# EasyEDA Pro project ProProject_运放实验_2024-09-24.epro, schematic Schematic2
Create Date: 2023-09-07; Page Name: P1; Project Name: 运放实验; Schematic Name: Schematic2; Update Date: 2023-09-08; Company: 嘉立创EDA; Page Size: A4; Version: V1.0
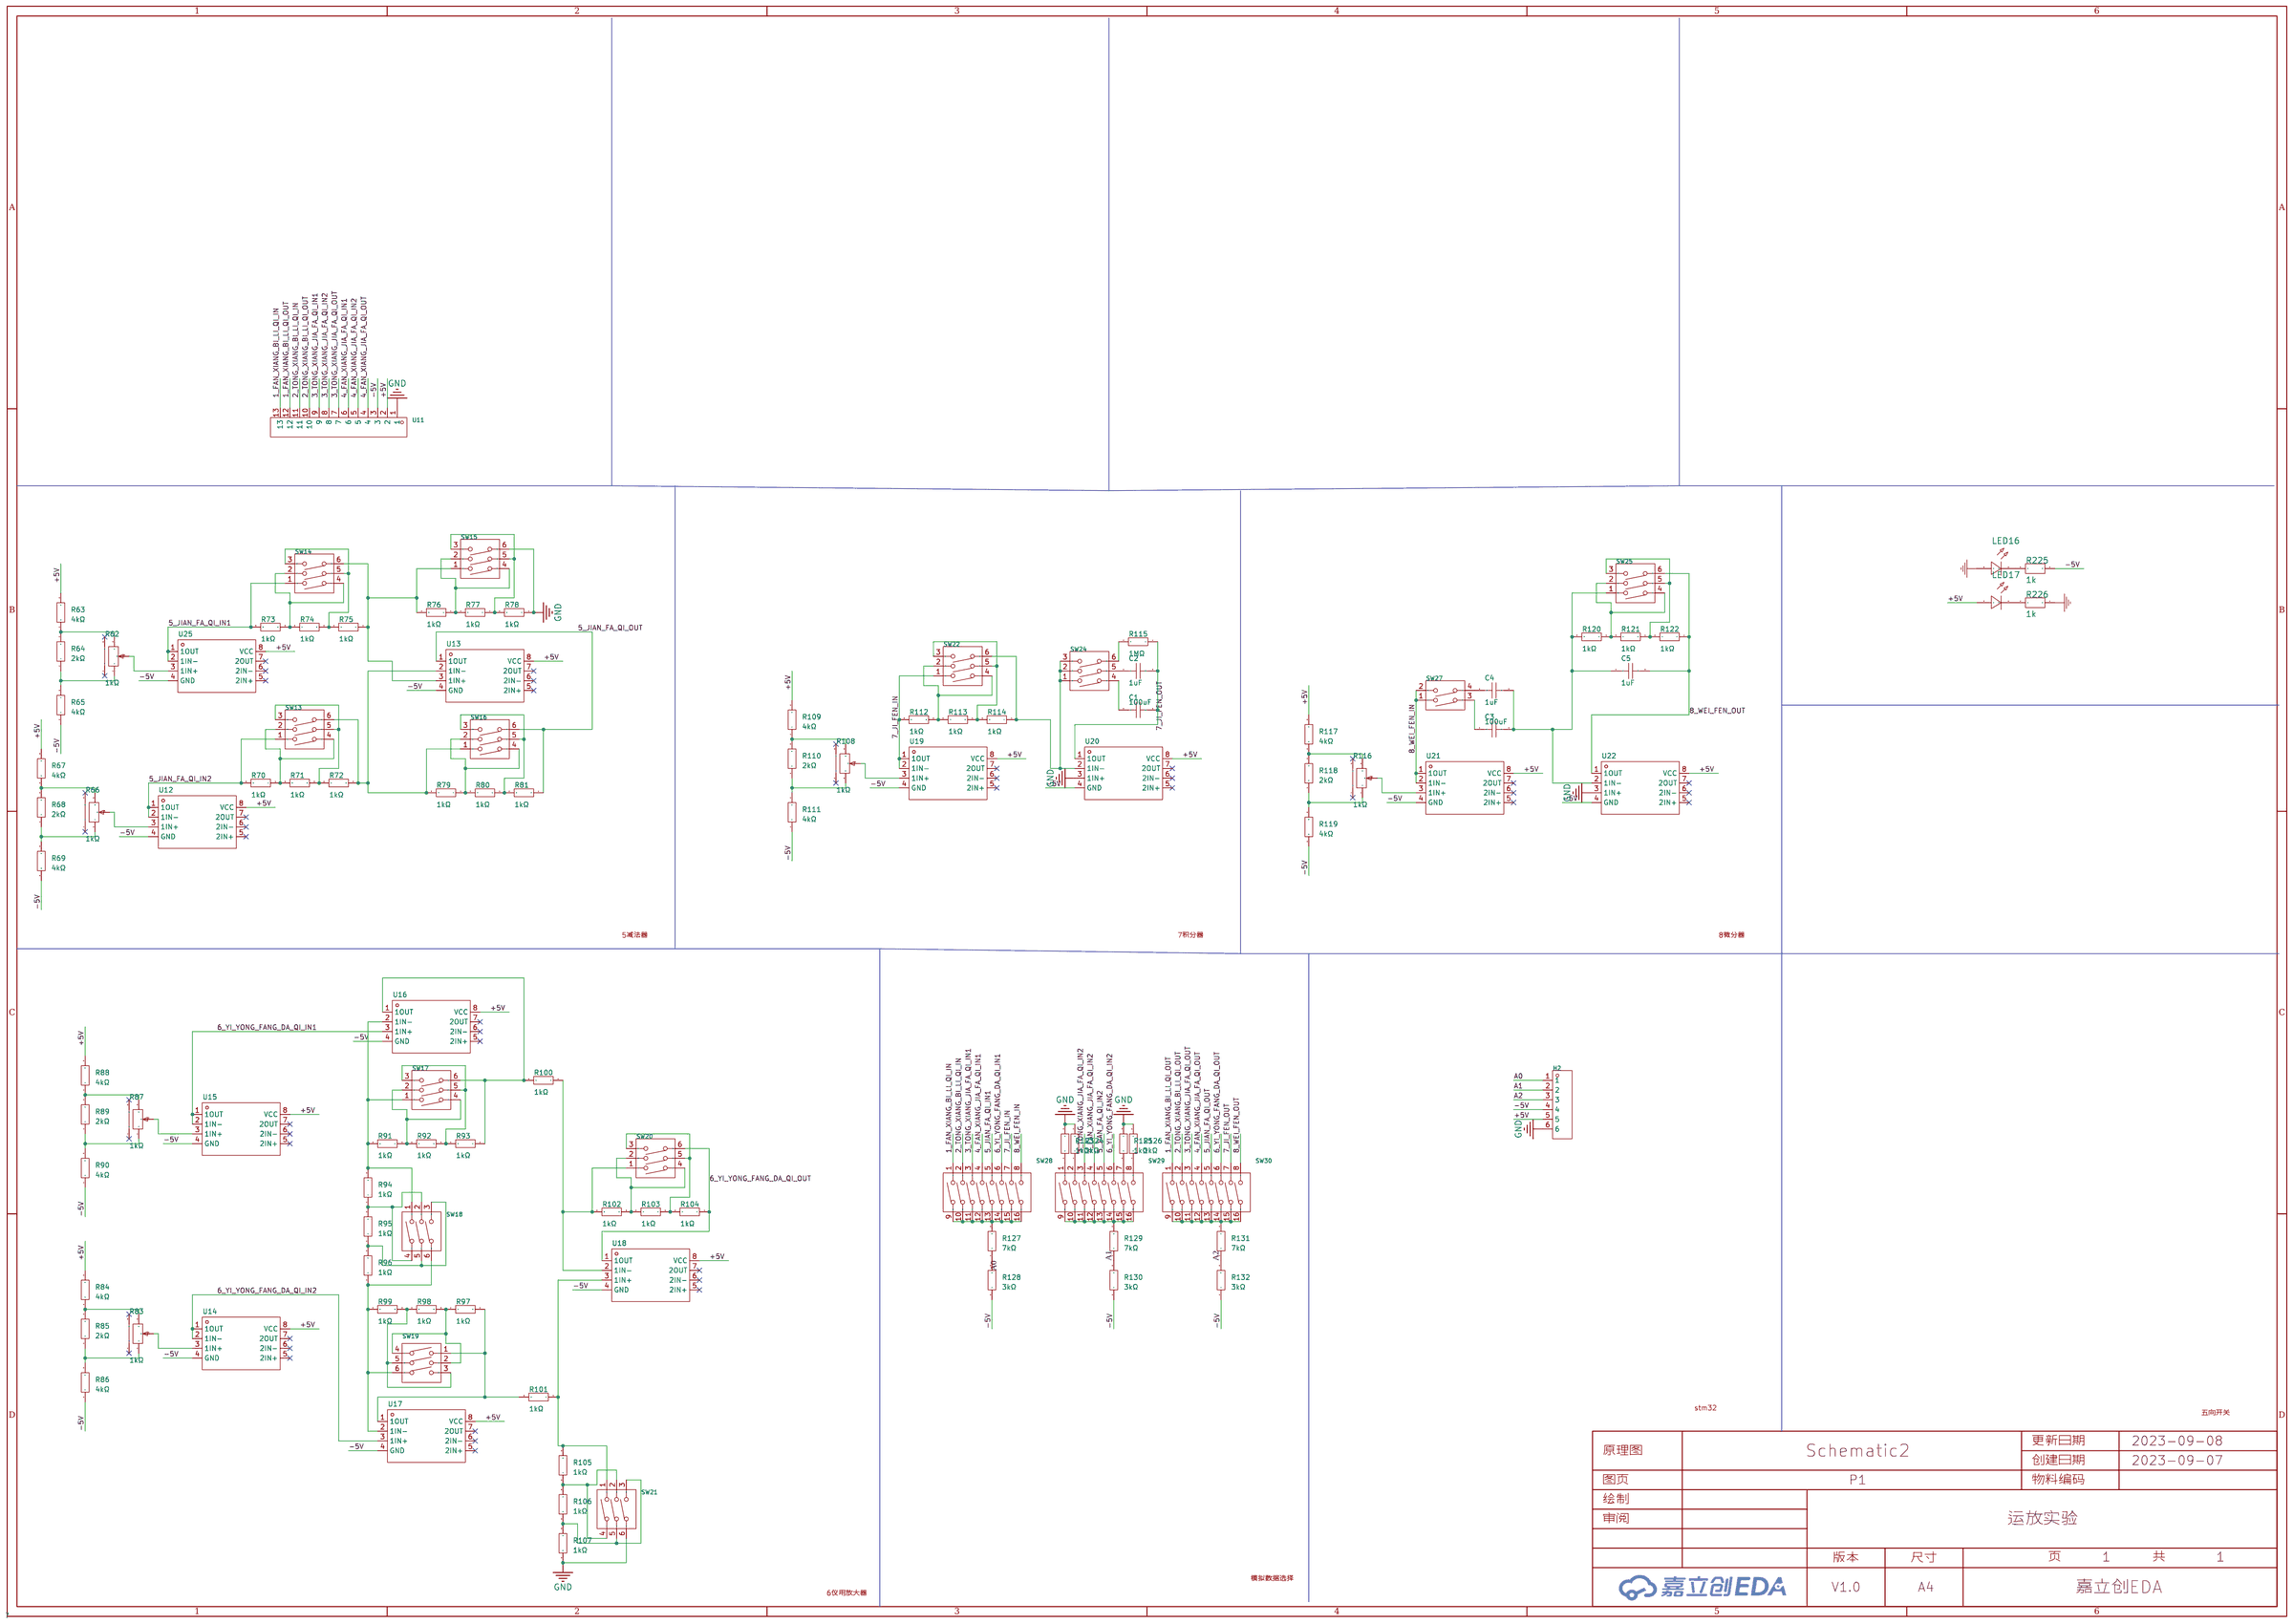
[diagram p1: schematic sheet]

## Parts
C1  100uF  [C0603]
C2  1uF  [C0603]
C3  100uF  [C0603]
C4  1uF  [C0603]
C5  1uF  [C0603]
H2  PM254V-11-06-H85  [HDR-TH_6P-P2.54-V-F]
LED16  -  [LED_0805]
LED17  -  [LED_0805]
R62  1kΩ  [RES-ADJ-TH_RK09K1130AJ3]
R63  4kΩ  [R0603]
R64  2kΩ  [R0603]
R65  4kΩ  [R0603]
R66  1kΩ  [RES-ADJ-TH_RK09K1130AJ3]
R67  4kΩ  [R0603]
R68  2kΩ  [R0603]
R69  4kΩ  [R0603]
R70  1kΩ  [R0603]
R71  1kΩ  [R0603]
R72  1kΩ  [R0603]
R73  1kΩ  [R0603]
R74  1kΩ  [R0603]
R75  1kΩ  [R0603]
R76  1kΩ  [R0603]
R77  1kΩ  [R0603]
R78  1kΩ  [R0603]
R79  1kΩ  [R0603]
R80  1kΩ  [R0603]
R81  1kΩ  [R0603]
R83  1kΩ  [RES-ADJ-TH_RK09K1130AJ3]
R84  4kΩ  [R0603]
R85  2kΩ  [R0603]
R86  4kΩ  [R0603]
R87  1kΩ  [RES-ADJ-TH_RK09K1130AJ3]
R88  4kΩ  [R0603]
R89  2kΩ  [R0603]
R90  4kΩ  [R0603]
R91  1kΩ  [R0603]
R92  1kΩ  [R0603]
R93  1kΩ  [R0603]
R94  1kΩ  [R0603]
R95  1kΩ  [R0603]
R96  1kΩ  [R0603]
R97  1kΩ  [R0603]
R98  1kΩ  [R0603]
R99  1kΩ  [R0603]
R100  1kΩ  [R0603]
R101  1kΩ  [R0603]
R102  1kΩ  [R0603]
R103  1kΩ  [R0603]
R104  1kΩ  [R0603]
R105  1kΩ  [R0603]
R106  1kΩ  [R0603]
R107  1kΩ  [R0603]
R108  1kΩ  [RES-ADJ-TH_RK09K1130AJ3]
R109  4kΩ  [R0603]
R110  2kΩ  [R0603]
R111  4kΩ  [R0603]
R112  1kΩ  [R0603]
R113  1kΩ  [R0603]
R114  1kΩ  [R0603]
R115  1MΩ  [R0603]
R116  1kΩ  [RES-ADJ-TH_RK09K1130AJ3]
R117  4kΩ  [R0603]
R118  2kΩ  [R0603]
R119  4kΩ  [R0603]
R120  1kΩ  [R0603]
R121  1kΩ  [R0603]
R122  1kΩ  [R0603]
R123  1kΩ  [R0603]
R124  1kΩ  [R0603]
R125  1kΩ  [R0603]
R126  1kΩ  [R0603]
R127  7kΩ  [R0603]
R128  3kΩ  [R0603]
R129  7kΩ  [R0603]
R130  3kΩ  [R0603]
R131  7kΩ  [R0603]
R132  3kΩ  [R0603]
R225  1k  [R0805]
R226  1k  [R0805]
SW13  DSWB03LHGET  [SW-TH_DSWB03LHGET]
SW14  DSWB03LHGET  [SW-TH_DSWB03LHGET]
SW15  DSWB03LHGET  [SW-TH_DSWB03LHGET]
SW16  DSWB03LHGET  [SW-TH_DSWB03LHGET]
SW17  DSWB03LHGET  [SW-TH_DSWB03LHGET]
SW18  DSWB03LHGET  [SW-TH_DSWB03LHGET]
SW19  DSWB03LHGET  [SW-TH_DSWB03LHGET]
SW20  DSWB03LHGET  [SW-TH_DSWB03LHGET]
SW21  DSWB03LHGET  [SW-TH_DSWB03LHGET]
SW22  DSWB03LHGET  [SW-TH_DSWB03LHGET]
SW24  DSWB03LHGET  [SW-TH_DSWB03LHGET]
SW25  DSWB03LHGET  [SW-TH_DSWB03LHGET]
SW27  DSWB02LHGET  [SW-TH_DSWB02LHGET]
SW28  DSWB08LHGET  [SW-TH_DSWB08LHGET]
SW29  DSWB08LHGET  [SW-TH_DSWB08LHGET]
SW30  DSWB08LHGET  [SW-TH_DSWB08LHGET]
U11  PM254-1-13-Z-8.5  [HDR-TH_13P-P2.54-V-F]
U12  LM393DR  [SOIC-8_L5.0-W4.0-P1.27-LS6.0-BL]
U13  LM393DR  [SOIC-8_L5.0-W4.0-P1.27-LS6.0-BL]
U14  LM393DR  [SOIC-8_L5.0-W4.0-P1.27-LS6.0-BL]
U15  LM393DR  [SOIC-8_L5.0-W4.0-P1.27-LS6.0-BL]
U16  LM393DR  [SOIC-8_L5.0-W4.0-P1.27-LS6.0-BL]
U17  LM393DR  [SOIC-8_L5.0-W4.0-P1.27-LS6.0-BL]
U18  LM393DR  [SOIC-8_L5.0-W4.0-P1.27-LS6.0-BL]
U19  LM393DR  [SOIC-8_L5.0-W4.0-P1.27-LS6.0-BL]
U20  LM393DR  [SOIC-8_L5.0-W4.0-P1.27-LS6.0-BL]
U21  LM393DR  [SOIC-8_L5.0-W4.0-P1.27-LS6.0-BL]
U22  LM393DR  [SOIC-8_L5.0-W4.0-P1.27-LS6.0-BL]
U25  LM393DR  [SOIC-8_L5.0-W4.0-P1.27-LS6.0-BL]

## Library data of the parts
C1-C5 = CAP_0603: Supplier Footprint: 0603
H2 = PM254V-11-06-H85: 排数:单排;总孔位数:6P;间距:2.54mm;插孔结构:1x6P;行距:-;安装类型:直插;圆孔/方孔:方孔;额定电流:3A;额定电压:250V;插孔方向:顶部;塑高:-;工作温度范围:-40℃~+105℃;; LCSC Part Name: 2.54mm 1x6P; Supplier Part: C2832269; Manufacturer: XFCN(兴飞); Supplier Footprint: 插件,P=2.54mm; JLCPCB Part Class: 扩展库; Datasheet: https://atta.szlcsc.com/upload/public/pdf/source/20210514/C2832269_B3EC97736B37C2783BDCE3050AA57447.pdf; Supplier: LCSC; Number of Rows: 单排; Number of Holes: 6P; Pitch: 2.54mm; Holes Structure: 1x6P; Mounting Type: 直插; Circular Hole / Square Hole: 方孔; Current Rating (Max): 3A; Voltage Rating (Max): 250V; Holes Direction: 顶部; Operating Temperature Range: -40℃~+105℃
LED16 LED17 = LED_0805-R: Supplier Footprint: 0805
R62 R66 R83 R87 R108 R116 = RK09K1130AJ3: 阻值:10kΩ;精度:±20%;功率:50mW;; LCSC Part Name: 10kΩ ±20%; Supplier Part: C388854; Manufacturer: ALPSALPINE(阿尔卑斯阿尔派); Supplier Footprint: 插件; JLCPCB Part Class: 扩展库; Datasheet: https://atta.szlcsc.com/upload/public/pdf/source/20190429/C388854_7CB4260EB45E5FBD5A81223BC5101220.pdf; Supplier: LCSC; Tolerance: ±20%; Power(Watts): 50mW; Rated Voltage: 20V
R63-R65 R67-R81 R84-R86 R88-R107 R109-R115 R117-R132 = 0603WAF1002T5E: 电阻类型:厚膜电阻;阻值:10kΩ;精度:±1%;功率:100mW;; LCSC Part Name: 厚膜电阻 10kΩ ±1% 100mW; Supplier Part: C25804; Manufacturer: UNI-ROYAL(厚声); Supplier Footprint: 0603; JLCPCB Part Class: 基础库; Datasheet: https://atta.szlcsc.com/upload/public/pdf/source/20200306/C422600_1E6D84923E4A46A82E41ADD87F860B5C.pdf; Supplier: LCSC; Type: 厚膜电阻; Tolerance: ±1%; Power(Watts): 100mW; Temperature Coefficient: ±100ppm/℃; Overload Voltage (Max): 75V; Operating Temperature Range: -55℃~+155℃
R225 R226 = 1k
SW13-SW22 SW24 SW25 = DSWB03LHGET: 类型:平拨,凸起式;电路结构:单刀单掷;开关位数:3;使用寿命:-;颜色:红色;; LCSC Part Name: 间距1.27mm 平拨,凸起式 3位拨码开关; Supplier Part: C99420; Manufacturer: YE; Supplier Footprint: 插件; JLCPCB Part Class: 扩展库; Datasheet: https://atta.szlcsc.com/upload/public/pdf/source/20170330/1490854274194.pdf; Supplier: LCSC; Type: 平拨,凸起式; Circuit: 单刀单掷; Number of Positions: 3; Lead Pitch: 2.54mm; Color: 红色
SW27 = DSWB02LHGET: 类型:平拨,凸起式;电路结构:单刀单掷;开关位数:2;使用寿命:-;颜色:红色;; LCSC Part Name: 拨码开关,平拨开关,DSWB02LHGET; Supplier Part: C99421; Manufacturer: YE; Supplier Footprint: 插件; JLCPCB Part Class: 扩展库; Datasheet: https://atta.szlcsc.com/upload/public/pdf/source/20170330/1490854270511.pdf; Supplier: LCSC; Type: 平拨,凸起式; Circuit: 单刀单掷; Number of Positions: 2; Lead Pitch: 2.54mm; Color: 红色
SW28-SW30 = DSWB08LHGET: 类型:平拨,凸起式;电路结构:单刀单掷;开关位数:8;使用寿命:-;颜色:红色;; LCSC Part Name: 间距2.54mm 平拨,凸起式  8位拨码开关; Supplier Part: C99413; Manufacturer: YE; Supplier Footprint: 插件; JLCPCB Part Class: 扩展库; Datasheet: https://atta.szlcsc.com/upload/public/pdf/source/20170330/1490854214069.pdf; Supplier: LCSC; Type: 平拨,凸起式; Circuit: 单刀单掷; Number of Positions: 8; Lead Pitch: 2.54mm; Color: 红色
U11 = PM254-1-13-Z-8.5: 排数:单排;总孔位数:13P;间距:2.54mm;插孔结构:1x13P;行距:-;安装类型:直插;圆孔/方孔:方孔;额定电流:3A;额定电压:-;插孔方向:顶部;塑高:8.5mm;工作温度范围:-40℃~+105℃;; LCSC Part Name: 2.54mm 1x13P; Supplier Part: C2897376; Manufacturer: HCTL(华灿天禄); Supplier Footprint: 插件,P=2.54mm; JLCPCB Part Class: 扩展库; Datasheet: https://atta.szlcsc.com/upload/public/pdf/source/20230609/534BE42964C679BDE98E061007C4ABD6.pdf; Supplier: LCSC; Number of Rows: 单排; Number of Holes: 13P; Pitch: 2.54mm; Holes Structure: 1x13P; Mounting Type: 直插; Circular Hole / Square Hole: 方孔; Current Rating (Max): 3A; Holes Direction: 顶部; Insulation Height: 8.5mm; Operating Temperature Range: -40℃~+105℃
U12-U22 U25 = LM393DR: 比较器组数:2;电源电压:2V~36V,±1V~18V;各通道供电电流:2.5mA;输出类型:CMOS, MOS, Open-Collector, TTL;传播延迟:-;; Supplier Part: C67470; Manufacturer: TI(德州仪器); Supplier Footprint: SOIC-8-150mil; JLCPCB Part Class: 扩展库; Datasheet: https://atta.szlcsc.com/upload/public/pdf/source/20160127/1457707757853.pdf; Supplier: LCSC; Number of Elements: 2; Supply Voltage（Single）: 2V~36V,±1V~18V; Iq per channel (Typ): 2.5mA; Output Type: CMOS, MOS, Open-Collector, TTL; Operating Temperature: 0°C ~ 70°C

## Nets
+5V: H2.5 LED17.2(A) R63.2 R67.2 R84.2 R88.2 R109.2 R117.2 U11.2 U12.8(VCC) U13.8(VCC) U14.8(VCC) U15.8(VCC) U16.8(VCC) U17.8(VCC) U18.8(VCC) U19.8(VCC) U20.8(VCC) U21.8(VCC) U22.8(VCC) U25.8(VCC)
-5V: H2.4 R65.1 R69.1 R86.1 R90.1 R111.1 R119.1 R128.1 R130.1 R132.1 R225.1 U11.3 U12.4(GND) U13.4(GND) U14.4(GND) U15.4(GND) U16.4(GND) U17.4(GND) U18.4(GND) U19.4(GND) U20.4(GND) U21.4(GND) U22.4(GND) U25.4(GND)
GND: H2.6 LED16.2(A) R78.1 R107.1 R123.2 R124.2 R125.2 R126.2 R226.1 SW15.6 SW21.6 U11.1 U20.3(1IN+) U22.3(1IN+)
1_FAN_XIANG_BI_LI_QI_IN: SW28.1 U11.13
1_FAN_XIANG_BI_LI_QI_OUT: SW30.1 U11.12
2_TONG_XIANG_BI_LI_QI_IN: SW28.2 U11.11
2_TONG_XIANG_BI_LI_QI_OUT: SW30.2 U11.10
3_TONG_XIANG_JIA_FA_QI_IN1: SW28.3 U11.9
3_TONG_XIANG_JIA_FA_QI_IN2: SW29.3 U11.8
3_TONG_XIANG_JIA_FA_QI_OUT: SW30.3 U11.7
4_FAN_XIANG_JIA_FA_QI_IN1: SW28.4 U11.6
4_FAN_XIANG_JIA_FA_QI_IN2: SW29.4 U11.5
4_FAN_XIANG_JIA_FA_QI_OUT: SW30.4 U11.4
5_JIAN_FA_QI_IN1: R73.2 SW14.1 SW28.5 U25.1(1OUT) U25.2(1IN-)
5_JIAN_FA_QI_IN2: R70.2 SW13.1 SW29.5 U12.1(1OUT) U12.2(1IN-)
5_JIAN_FA_QI_OUT: R81.1 SW16.6 SW30.5 U13.1(1OUT)
6_YI_YONG_FANG_DA_QI_IN1: SW28.6 U15.1(1OUT) U15.2(1IN-) U16.3(1IN+)
6_YI_YONG_FANG_DA_QI_IN2: SW29.6 U14.1(1OUT) U14.2(1IN-) U17.3(1IN+)
6_YI_YONG_FANG_DA_QI_OUT: R104.1 SW20.6 SW30.6 U18.1(1OUT)
7_JI_FEN_IN: R112.2 SW22.1 SW28.7 U19.1(1OUT) U19.2(1IN-)
7_JI_FEN_OUT: C1.2 C2.2 R115.1 SW30.7 U20.1(1OUT)
8_WEI_FEN_IN: SW27.1 SW27.2 SW28.8 U21.1(1OUT) U21.2(1IN-)
8_WEI_FEN_OUT: C5.2 R122.1 SW25.6 SW30.8 U22.1(1OUT)
A0: H2.1 R127.1 R128.2
A1: H2.2 R129.1 R130.2
A2: H2.3 R131.1 R132.2
$1N41163: R123.1 SW29.1
$1N41164: R124.1 SW29.2
$1N41165: R125.1 SW29.7
$1N41166: R126.1 SW29.8
$1N41258: R127.2 SW28.9 SW28.10 SW28.11 SW28.12 SW28.13 SW28.14 SW28.15 SW28.16
$1N41259: R129.2 SW29.9 SW29.10 SW29.11 SW29.12 SW29.13 SW29.14 SW29.15 SW29.16
$1N41260: R131.2 SW30.9 SW30.10 SW30.11 SW30.12 SW30.13 SW30.14 SW30.15 SW30.16
$1N44165: LED16.1(C) R225.2
$1N44169: LED17.1(C) R226.2
Net-(C1-1): C1.1 SW24.4
Net-(C2-1): C2.1 SW24.5
Net-(C3-1): C3.1 SW27.3
Net-(C3-2): C3.2 C4.2 C5.1 R120.2 SW25.1 U22.2(1IN-)
Net-(C4-1): C4.1 SW27.4
Net-(R62-1): R62.1 R64.1 R65.2
Net-(R62-2): R62.2 U25.3(1IN+)
Net-(R62-3): R62.3 R63.1 R64.2
Net-(R66-1): R66.1 R68.1 R69.2
Net-(R66-2): R66.2 U12.3(1IN+)
Net-(R66-3): R66.3 R67.1 R68.2
Net-(R70-1): R70.1 R71.2 SW13.2 SW13.4
Net-(R71-1): R71.1 R72.2 SW13.3 SW13.5
Net-(R72-1): R72.1 R79.2 SW13.6 SW16.1 U13.2(1IN-)
Net-(R73-1): R73.1 R74.2 SW14.2 SW14.4
Net-(R74-1): R74.1 R75.2 SW14.3 SW14.5
Net-(R75-1): R75.1 R76.2 SW14.6 SW15.1 U13.3(1IN+)
Net-(R76-1): R76.1 R77.2 SW15.2 SW15.4
Net-(R77-1): R77.1 R78.2 SW15.3 SW15.5
Net-(R79-1): R79.1 R80.2 SW16.2 SW16.4
Net-(R80-1): R80.1 R81.2 SW16.3 SW16.5
Net-(R83-1): R83.1 R85.1 R86.2
Net-(R83-2): R83.2 U14.3(1IN+)
Net-(R83-3): R83.3 R84.1 R85.2
Net-(R87-1): R87.1 R89.1 R90.2
Net-(R87-2): R87.2 U15.3(1IN+)
Net-(R87-3): R87.3 R88.1 R89.2
Net-(R91-1): R91.1 R92.2 SW17.2 SW17.4
Net-(R91-2): R91.2 R94.2 SW17.1 SW18.1 U16.2(1IN-)
Net-(R92-1): R92.1 R93.2 SW17.3 SW17.5
Net-(R93-1): R93.1 R100.2 SW17.6 U16.1(1OUT)
Net-(R94-1): R94.1 R95.2 SW18.2 SW18.4
Net-(R95-1): R95.1 R96.2 SW18.3 SW18.5
Net-(R96-1): R96.1 R99.1 SW18.6 SW19.6 U17.2(1IN-)
Net-(R97-1): R97.1 R98.2 SW19.2 SW19.4
Net-(R97-2): R97.2 R101.2 SW19.1 U17.1(1OUT)
Net-(R98-1): R98.1 R99.2 SW19.3 SW19.5
Net-(R100-1): R100.1 R102.2 SW20.1 U18.2(1IN-)
Net-(R101-1): R101.1 R105.2 SW21.1 U18.3(1IN+)
Net-(R102-1): R102.1 R103.2 SW20.2 SW20.4
Net-(R103-1): R103.1 R104.2 SW20.3 SW20.5
Net-(R105-1): R105.1 R106.2 SW21.2 SW21.4
Net-(R106-1): R106.1 R107.2 SW21.3 SW21.5
Net-(R108-1): R108.1 R110.1 R111.2
Net-(R108-2): R108.2 U19.3(1IN+)
Net-(R108-3): R108.3 R109.1 R110.2
Net-(R112-1): R112.1 R113.2 SW22.2 SW22.4
Net-(R113-1): R113.1 R114.2 SW22.3 SW22.5
Net-(R114-1): R114.1 SW22.6 SW24.1 SW24.2 SW24.3 U20.2(1IN-)
Net-(R115-2): R115.2 SW24.6
Net-(R116-1): R116.1 R118.1 R119.2
Net-(R116-2): R116.2 U21.3(1IN+)
Net-(R116-3): R116.3 R117.1 R118.2
Net-(R120-1): R120.1 R121.2 SW25.2 SW25.4
Net-(R121-1): R121.1 R122.2 SW25.3 SW25.5

Not connected (* = marked no-connect by the designer): R62 4* 5*; R66 4* 5*; R83 4* 5*; R87 4* 5*; R108 4* 5*; R116 4* 5*; U12 5(2IN+)* 6(2IN-)* 7(2OUT)*; U13 5(2IN+)* 6(2IN-)* 7(2OUT)*; U14 5(2IN+)* 6(2IN-)* 7(2OUT)*; U15 5(2IN+)* 6(2IN-)* 7(2OUT)*; U16 5(2IN+)* 6(2IN-)* 7(2OUT)*; U17 5(2IN+)* 6(2IN-)* 7(2OUT)*; U18 5(2IN+)* 6(2IN-)* 7(2OUT)*; U19 5(2IN+)* 6(2IN-)* 7(2OUT)*; U20 5(2IN+)* 6(2IN-)* 7(2OUT)*; U21 5(2IN+)* 6(2IN-)* 7(2OUT)*; U22 5(2IN+)* 6(2IN-)* 7(2OUT)*; U25 5(2IN+)* 6(2IN-)* 7(2OUT)*

## Notes on the sheet
- 5减法器
- 7积分器
- 8微分器
- stm32
- 五向开关
- 模拟数据选择
- 6仪用放大器
